# EAGLE design godmd_V1_final (EAGLE 7.1.0)
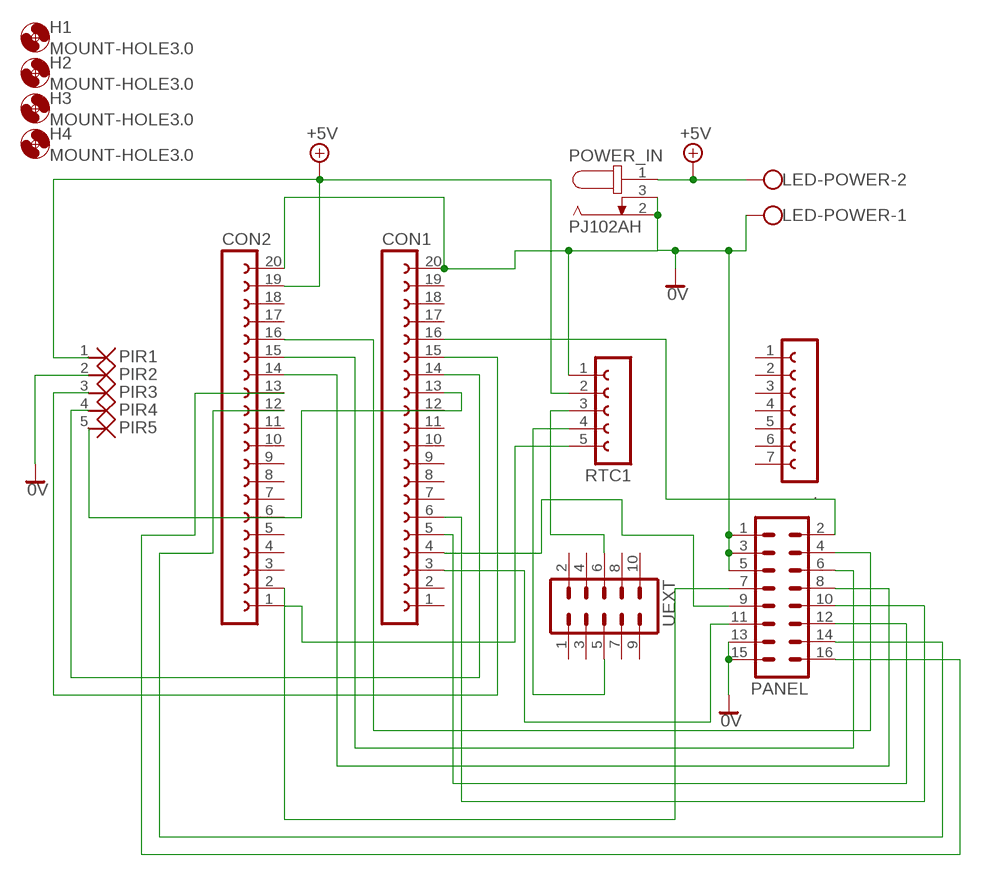
[diagram p0: schematic, sheet 1]

## Parts
.  FE07-1  [FE07]
CON1  FE20-1  [FE20]
CON2  FE20-1  [FE20]
H1  MOUNT-HOLE3.0  [3,0]
H2  MOUNT-HOLE3.0  [3,0]
H3  MOUNT-HOLE3.0  [3,0]
H4  MOUNT-HOLE3.0  [3,0]
LED-POWER  W237-102  [W237-102]
PANEL  MA08-2  [MA08-2]
PIR  PS25_5  [PS25_5]
POWER_IN  PJ102AH  [PJ102]
RTC1  FE05-1  [FE05-1]
UEXT  ML10  [ML10]

## Nets
0V: CON1.20 CON2.20 LED-POWER.1 PANEL.1 PANEL.3 PANEL.5 PANEL.13 PANEL.15 PIR.2 POWER_IN.2 POWER_IN.3 RTC1.1
+5V: CON2.19 LED-POWER.2 PIR.1 POWER_IN.1 RTC1.2
A: CON1.16 PANEL.2
B: CON2.16 PANEL.4
C: CON2.15 PANEL.6
CLK: CON2.13 PANEL.16
D: CON2.14 PANEL.8
GD1: CON1.6 PANEL.10
GD2: CON1.5 PANEL.12
IRREC: CON1.14 PIR.4
LAT: CON2.12 PANEL.14
N$1: RTC1.3 UEXT.6
N$2: RTC1.4 UEXT.5
N$3: CON2.1 RTC1.5
N$14: CON2.2 PANEL.7
PIR-AUX: CON1.13 PIR.5
PIRDATA: CON1.15 PIR.3
RD1: CON1.4 PANEL.9
RD2: CON1.3 PANEL.11
Unconnected: ..1 ..2 ..3 ..4 ..5 ..6 ..7 CON1.1 CON1.2 CON1.7 CON1.8 CON1.9 CON1.10 CON1.11 CON1.12 CON1.17 CON1.18 CON1.19 CON2.3 CON2.4 CON2.5 CON2.6 CON2.7 CON2.8 CON2.9 CON2.10 CON2.11 CON2.17 CON2.18 UEXT.1 UEXT.2 UEXT.3 UEXT.4 UEXT.7 UEXT.8 UEXT.9 UEXT.10

## Library data of the parts
. = con-lsta:FE07-1: FEMALE HEADER; OC_FARNELL: unknown; OC_NEWARK: unknown
CON1 CON2 = con-lsta:FE20-1: FEMALE HEADER; OC_FARNELL: unknown; OC_NEWARK: unknown
H1-H4 = holes:MOUNT-HOLE: MOUNTING HOLE with drill center marker
LED-POWER = con-wago-500:W237-102: WAGO SCREW CLAMP; MPN: 237-102; OC_FARNELL: unknown; OC_NEWARK: 70K9898
PANEL = con-lstb:MA08-2: PIN HEADER; OC_FARNELL: unknown; OC_NEWARK: unknown
PIR = con_PS25:PS25_5
POWER_IN = con-jack:PJ102AH
RTC1 = con-lsta:FE05-1: FEMALE HEADER; OC_FARNELL: unknown; OC_NEWARK: unknown
UEXT = con-harting-ml:ML10: HARTING; OC_FARNELL: unknown; OC_NEWARK: unknown

## Board
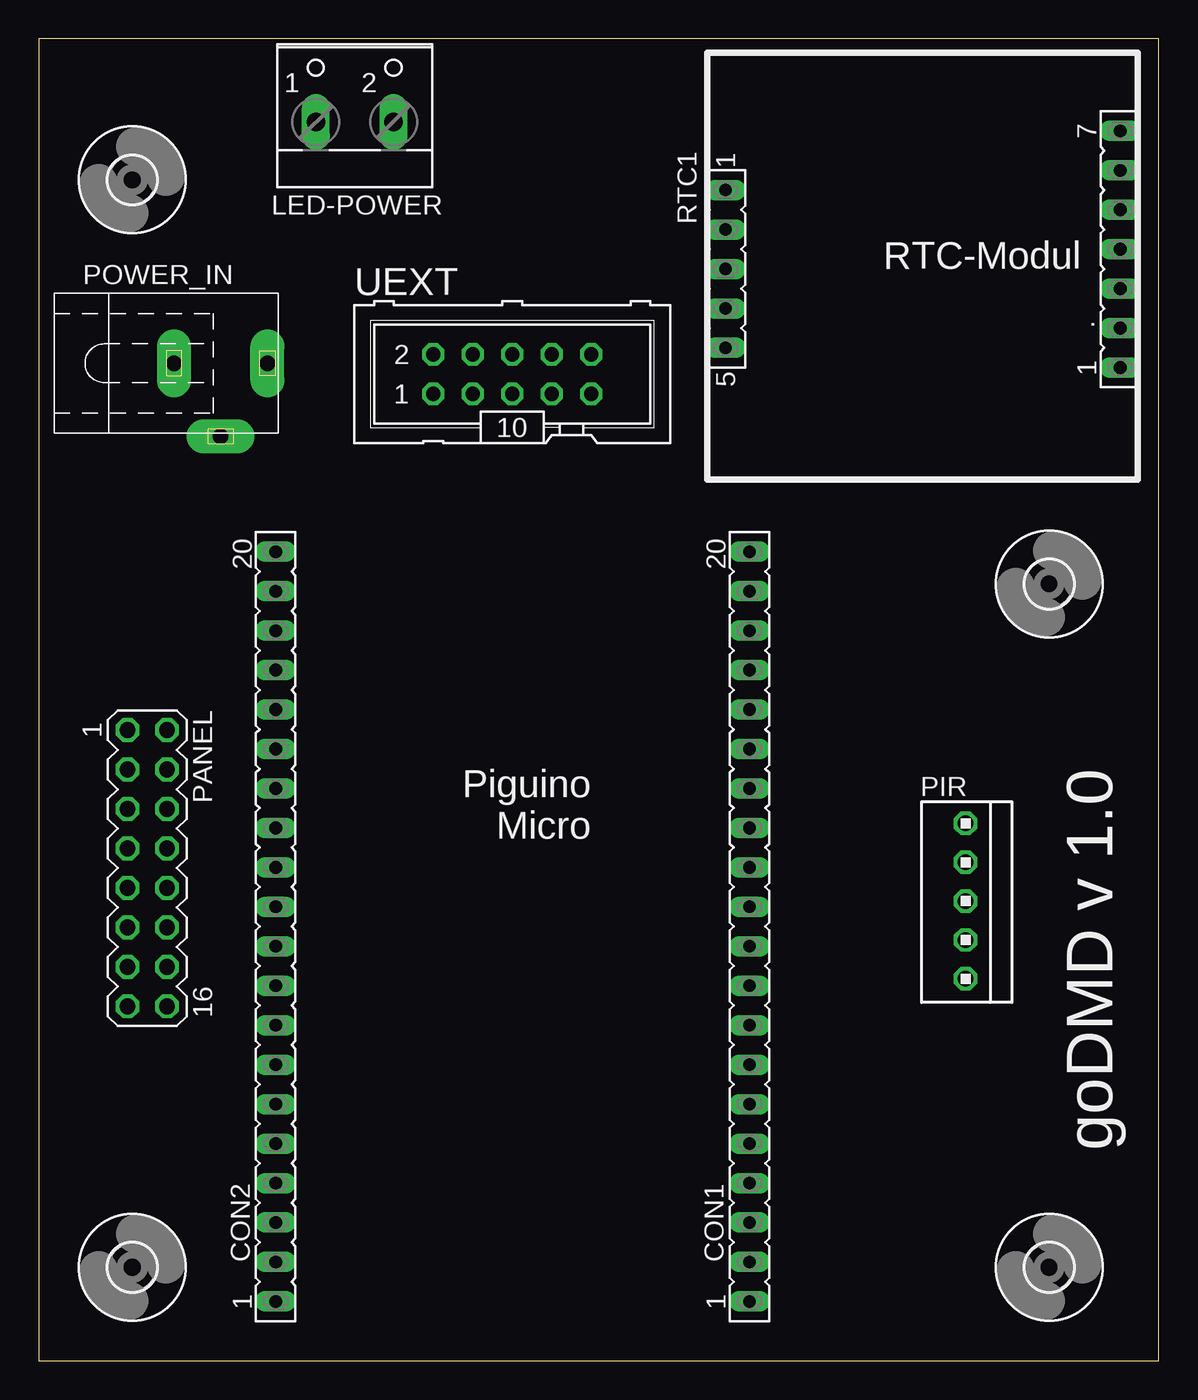
[diagram p1: board, top side]
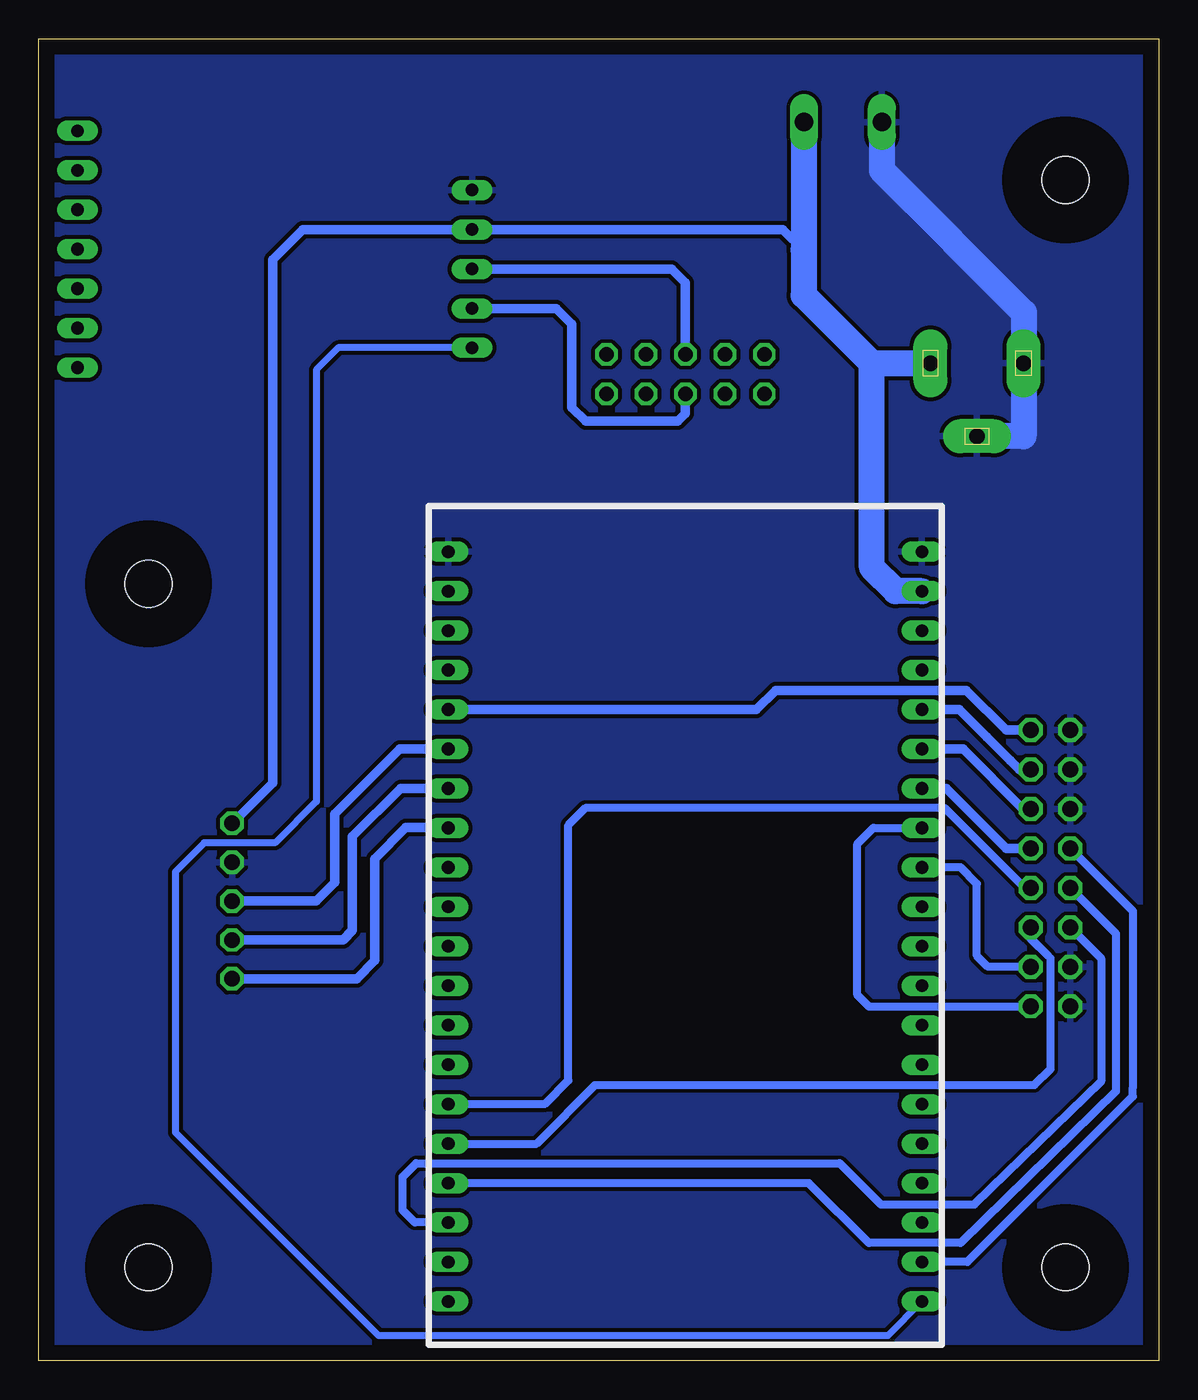
[diagram p2: board, bottom side, seen from below]

Size 72.06 x 85.08 mm. Coordinates in mm from the lower left corner, seen from the top.
Outline: 0,0 72.06,0 72.06,85.08 0,85.08 0,0
Copper layers (1*16): Top 0.035mm / dielectric 1.5mm / Bottom 0.035mm
Design rules "Bilex DRU": minimum track width 10mil, minimum drill 24mil, track to track 10mil, track to pad 10mil, pad to pad 10mil, via to via 10mil, smd to smd 10mil, copper to edge 40mil, drill to drill 8mil, minimum pad ring 10mil, minimum via ring 8mil, stop-mask expansion 4mil, vias tented up to drill 0mil, thermal gap 10mil

### Footprints (pad centres in the part's own frame; a part is rotated, then mirrored left to right if it is on the bottom)
FE07 = drill 0.813 long: 1 -7.62,0; 2 -5.08,0; 3 -2.54,0; 4 0,0; 5 2.54,0; 6 5.08,0; 7 7.62,0
FE20 = drill 0.813 long: 1 -24.13,0; 2 -21.59,0; 3 -19.05,0; 4 -16.51,0; 5 -13.97,0; 6 -11.43,0; 7 -8.89,0; 8 -6.35,0; 9 -3.81,0; 10 -1.27,0; 11 1.27,0; 12 3.81,0; 13 6.35,0; 14 8.89,0; 15 11.43,0; 16 13.97,0; 17 16.51,0; 18 19.05,0; 19 21.59,0; 20 24.13,0
3,0 = hole 3: 0,0
W237-102 = drill 1.194 long: 1 -2.5,-1.27; 2 2.5,-1.27
MA08-2 = drill 1.016 octagon: 1 -8.89,-1.27; 2 -8.89,1.27; 3 -6.35,-1.27; 4 -6.35,1.27; 5 -3.81,-1.27; 6 -3.81,1.27; 7 -1.27,-1.27; 8 -1.27,1.27; 9 1.27,-1.27; 10 1.27,1.27; 11 3.81,-1.27; 12 3.81,1.27; 13 6.35,-1.27; 14 6.35,1.27; 15 8.89,-1.27; 16 8.89,1.27
PS25_5 = drill 1 octagon: 1 -1.25,-0.88; 2 1.25,-0.88; 3 3.75,-0.88; 4 6.25,-0.88; 5 8.75,-0.88
PJ102 = drill 1 pad 2.184 long: 1 3,0; 2 -3,0; 3 0,-4.7
FE05-1 = drill 0.813 long: 1 -5.08,0; 2 -2.54,0; 3 0,0; 4 2.54,0; 5 5.08,0
ML10 = drill 0.914 octagon: 1 -5.08,-1.27; 2 -5.08,1.27; 3 -2.54,-1.27; 4 -2.54,1.27; 5 0,-1.27; 6 0,1.27; 7 2.54,-1.27; 8 2.54,1.27; 9 5.08,-1.27; 10 5.08,1.27

### Placement (x,y rotation side)
.  69.58,71.54 90 top
CON1  45.72,27.94 90 top
CON2  15.24,27.94 90 top
H1  65,6 0 top
H2  6,6 0 top
H3  65,50 0 top
H4  6,76 0 top
LED-POWER  20.32,81 0 top
PANEL  6.97,31.7 270 top
PIR  60.51,33.33 270 top
POWER_IN  11.7,64.2 0 top
RTC1  44.18,70.27 270 top
UEXT  30.45,63.5 0 top

### Tracks (layer width: path | path; a pad name or v marks a point on that pad's centre or on a via)
0V
  Bottom 1.676: LED-POWER.1 17.82,76.61 8.68,67.47 8.68,64.22 POWER_IN.2 8.7,59.5 POWER_IN.3
  pour Bottom: 0,0 72.06,0 72.06,85.09 0,85.09
+5V
  Bottom 0.406: LED-POWER.2 22.86,80.01
  Bottom 0.61: PIR.1 57.02,37.19 57.02,70.86 55.07,72.81 RTC1.2 24.19,72.81 22.86,71.48
  Bottom 1.676: 18.48,64.2 22.86,68.58 22.86,71.48 22.86,80.01 | 18.48,64.2 POWER_IN.1 | CON2.19 16.94,49.53 18.46,51.05 18.46,64.18 18.48,64.2
A
  Bottom 0.61: PANEL.2 9.83,40.59 12.39,43.15 24.66,43.15 25.9,41.91 CON1.16
B
  Bottom 0.61: CON2.16 12.84,41.91 11.06,40.13 9.56,38.63 8.98,38.05 PANEL.4
C
  Bottom 0.61: CON2.15 14.72,39.37 | 14.72,39.37 13.69,39.37 | PANEL.6 8.74,35.51 12.59,39.36 14.71,39.36 14.72,39.37
CLK
  Bottom 0.406: 8.27,22.78 PANEL.16
  Bottom 0.5: 8.27,22.78 18.64,22.78 19.4,23.54 19.4,33.26 18.37,34.29 CON2.13
D
  Bottom 0.61: CON2.14 13.69,36.83 9.83,32.97 PANEL.8
GD1
  Bottom 0.5: CON1.6 39.51,16.51 37.99,18.03 37.99,34.47 36.9,35.56 13.77,35.56 8.64,30.43 PANEL.10
GD2
  Bottom 0.5: CON1.5 40.03,13.97 36.26,17.74 8.01,17.74 6.97,18.76 6.97,25.9 7.13,26.05 | 8.24,27.15 7.13,26.05 | PANEL.12 8.24,27.17 7.13,26.05
IRREC
  Bottom 0.61: CON1.14 48.78,36.83 51.88,33.73 51.88,27.69 52.49,27.08 PIR.4
LAT
  Bottom 0.5: PANEL.14 10.99,25.35 11.7,26.06 11.7,30.7 12.75,31.75 CON2.12
N$1
  Bottom 0.61: RTC1.3 31.34,70.27 30.46,69.39 UEXT.6
N$2
  Bottom 0.61: UEXT.5 30.45,60.95 30.94,60.47 36.88,60.47 37.76,61.35 37.76,66.72 38.76,67.72 RTC1.4
N$3
  Bottom 0.45: RTC1.5 52.8,65.19 54.21,63.78 54.21,35.98 56.86,33.33 61.42,33.33 63.28,31.47 63.28,14.69 50.22,1.63 17.42,1.63 CON2.1
N$14
  Bottom 0.5: CON2.2 12.32,6.35 1.67,17 1.67,17.6 1.67,20.6 1.67,28.94 PANEL.7
PIR-AUX
  Bottom 0.406: 45.74,34.31 45.72,34.31 CON1.13
  Bottom 0.61: 45.74,34.31 48.44,34.31 50.45,32.3 50.45,25.75 51.62,24.58 PIR.5
PIRDATA
  Bottom 0.61: CON1.15 48.84,39.37 53.01,35.2 53.01,30.77 54.2,29.58 PIR.3
RD1
  Bottom 0.5: CON1.4 22.52,11.43 18.66,7.57 12.75,7.57 2.74,17.36 2.74,27.47 PANEL.9
RD2
  Bottom 0.5: CON1.3 47.86,8.89 48.66,9.69 48.66,11.84 47.79,12.71 20.53,12.71 17.88,10.06 11.87,10.06 3.71,17.97 3.71,25.9 PANEL.11

### Text on the board
tNames: RTC-Modul | Piguino / Micro | goDMD v 1.0